# Altium schematic sheet 03 POWER TREE.SchDoc
size 420 x 297 mm
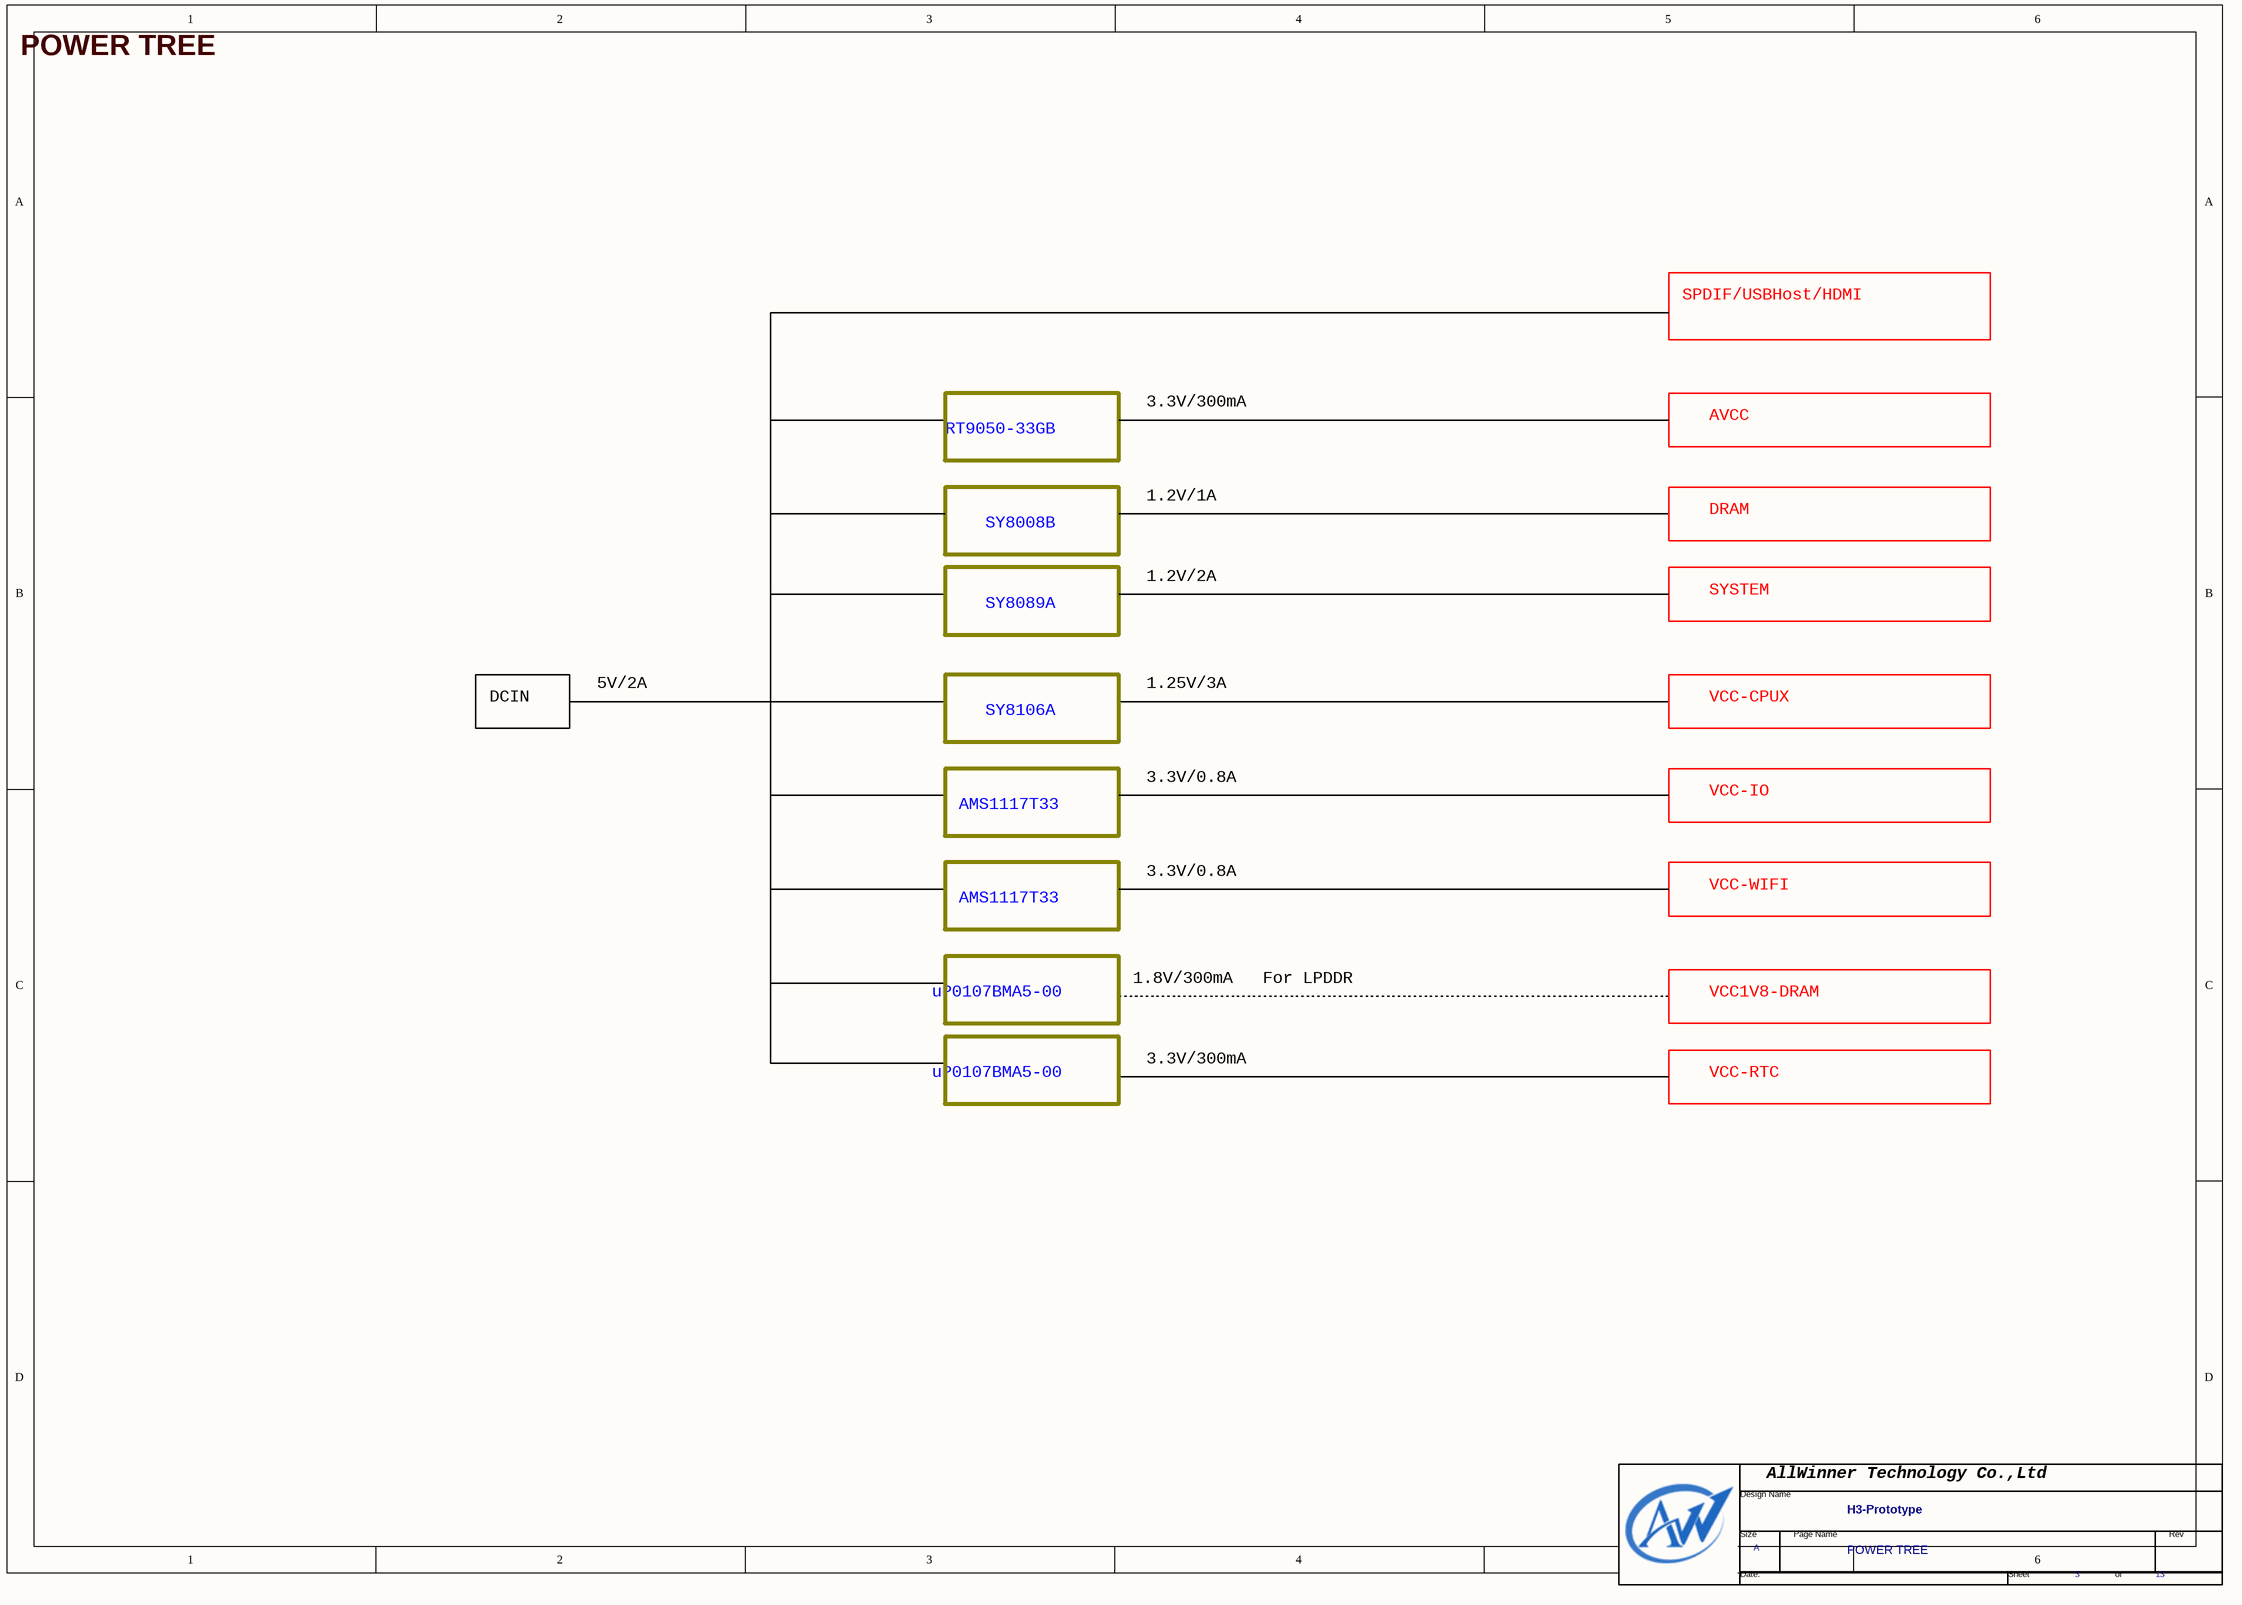
[diagram p0: 03 POWER TREE.SchDoc]

## Parts
*  Page Count: 13  Page Number: 3  Page Size: A  Title: H3-Prototype  Doc: POWER TREE  (hidden comment: TitleBlock0-AW)  (graphical)

## Notes on the sheet
- POWER TREE
- SPDIF/USBHost/HDMI
- RT9050-33GB
- 3.3V/300mA
- AVCC
- SY8008B
- 1.2V/1A
- DRAM
- 1.2V/2A
- SYSTEM
- SY8089A
- DCIN
- 5V/2A
- SY8106A
- 1.25V/3A
- VCC-CPUX
- 3.3V/0.8A
- VCC-IO
- AMS1117T33
- VCC-WIFI
- uP0107BMA5-00
- 1.8V/300mA   For LPDDR
- VCC1V8-DRAM
- VCC-RTC
- (in symbol TitleBlock0-AW) AllWinner Technology Co.,Ltd; Design Name; Size; Page Name; Rev; Date:; Sheet; of

## Library data of the parts
* = TitleBlock0-AW: Page Create Date: March  8, 1995